# Altium schematic sheet COEXPIX schematics.SchDoc
size A4
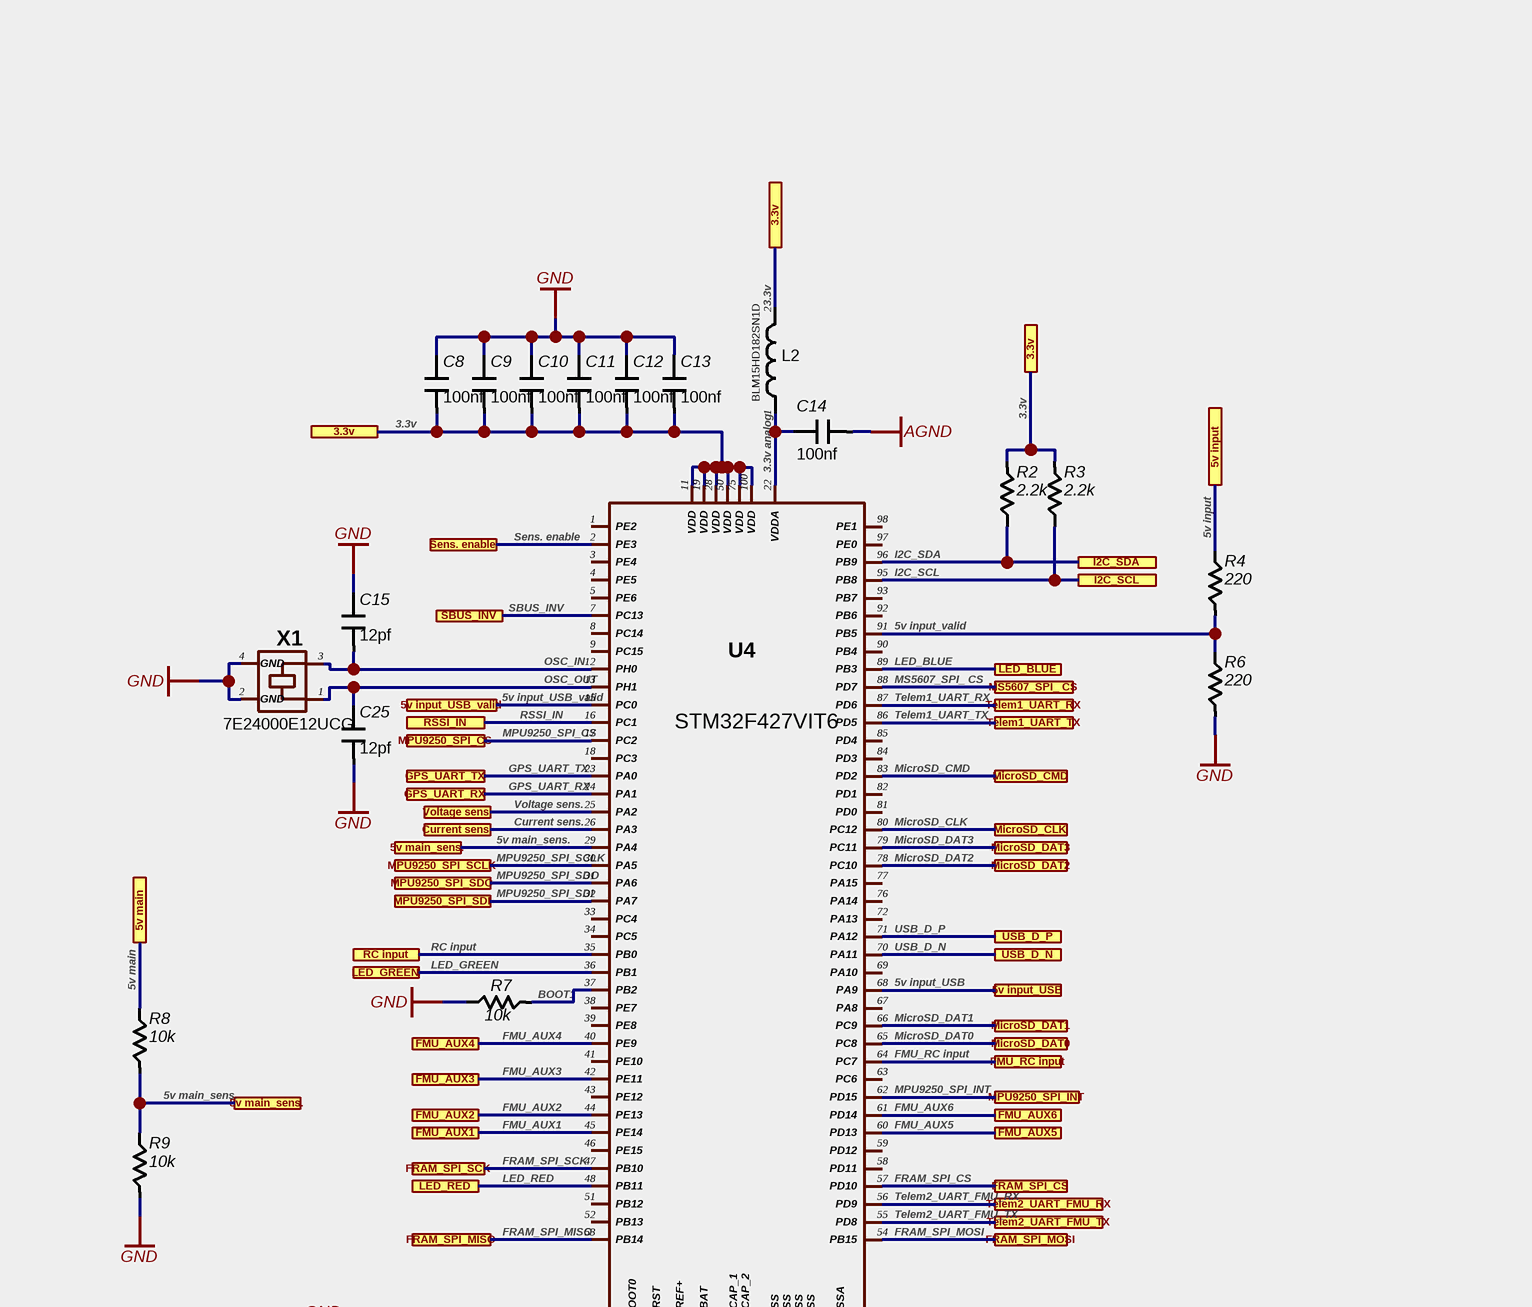
[diagram p0: COEXPIX schematics.SchDoc, top left]
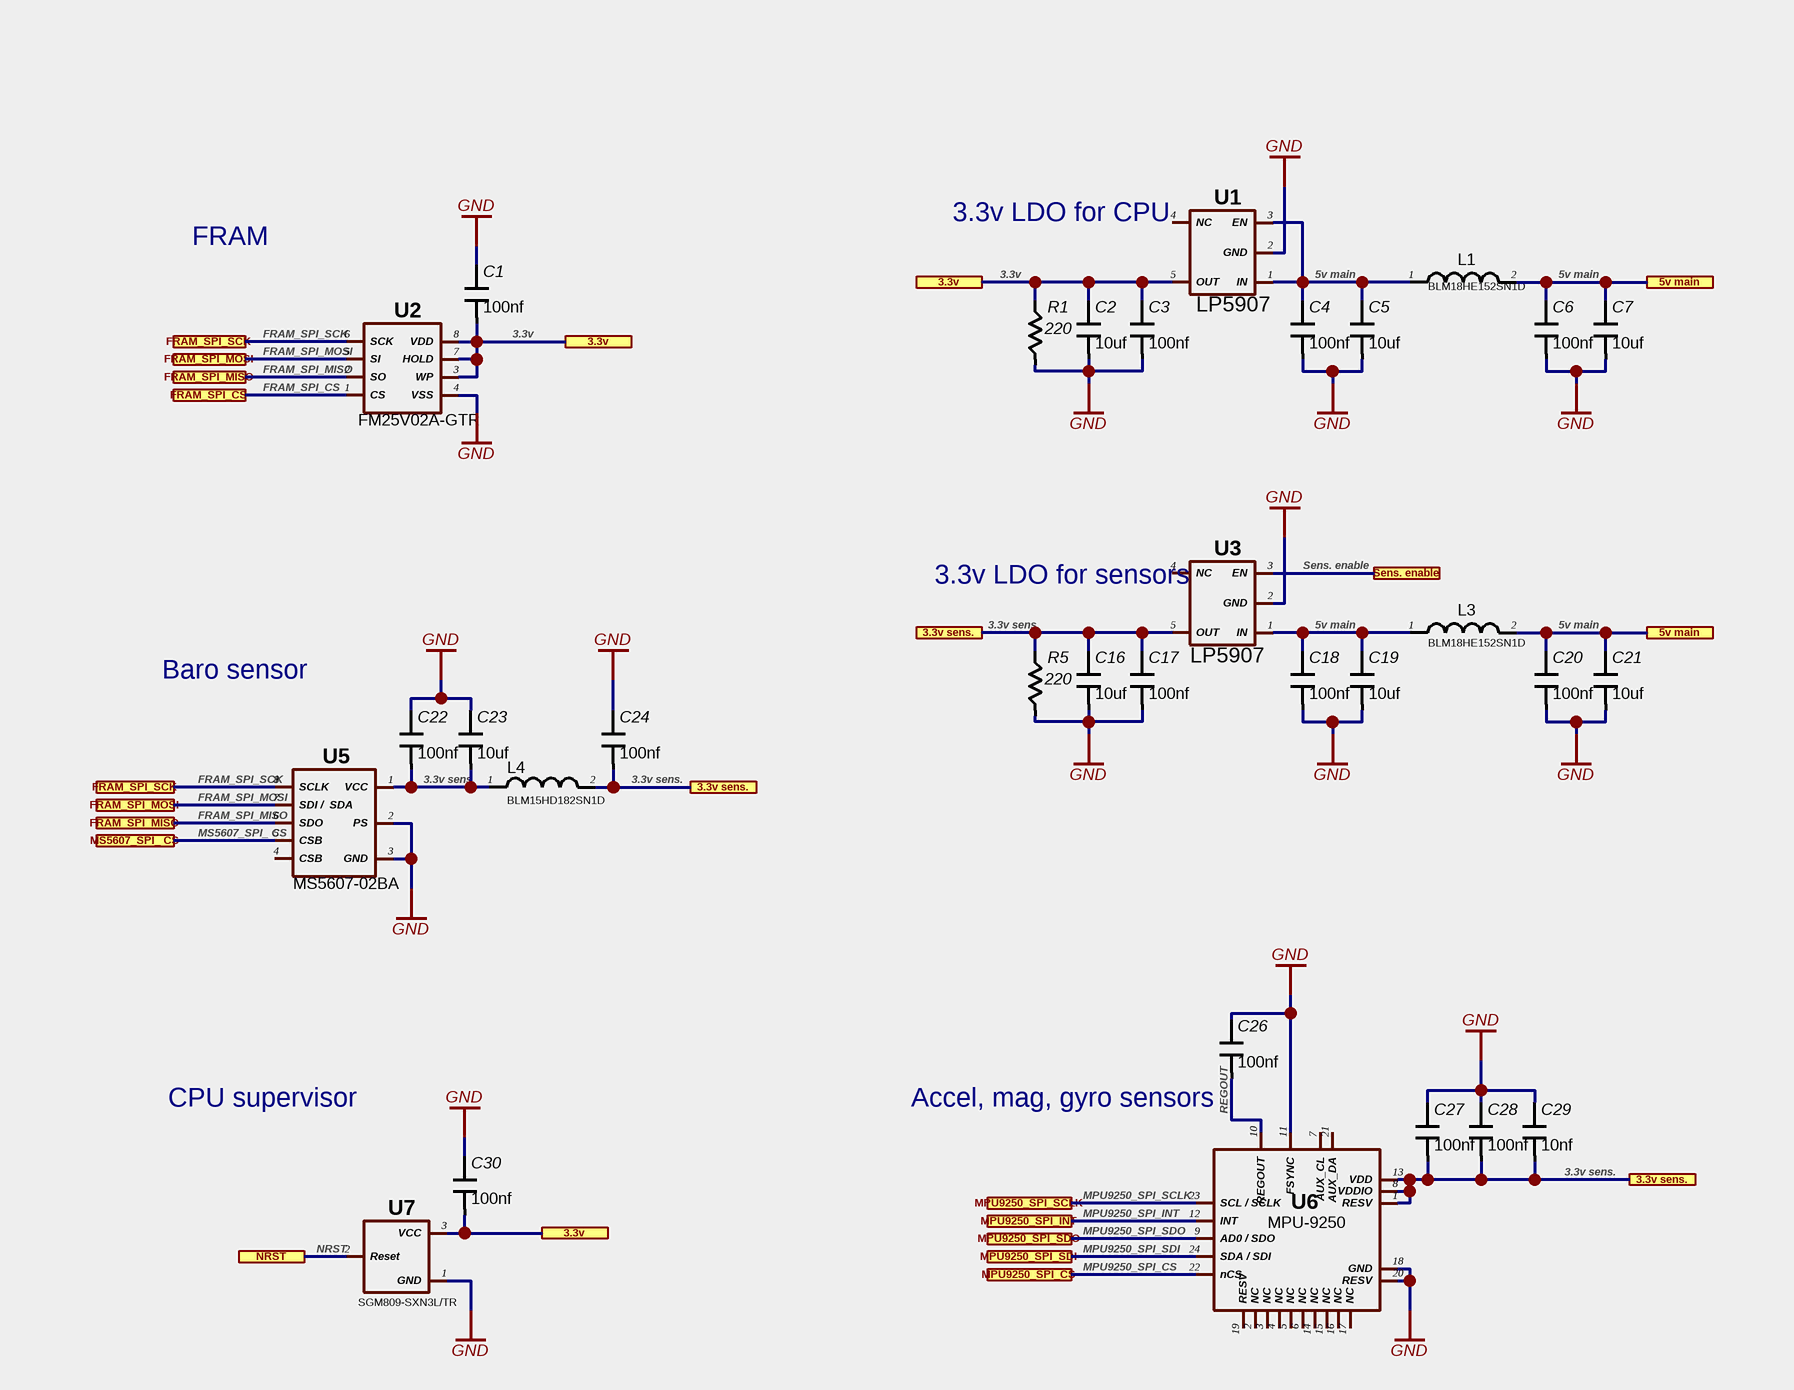
[diagram p1: COEXPIX schematics.SchDoc, top right]
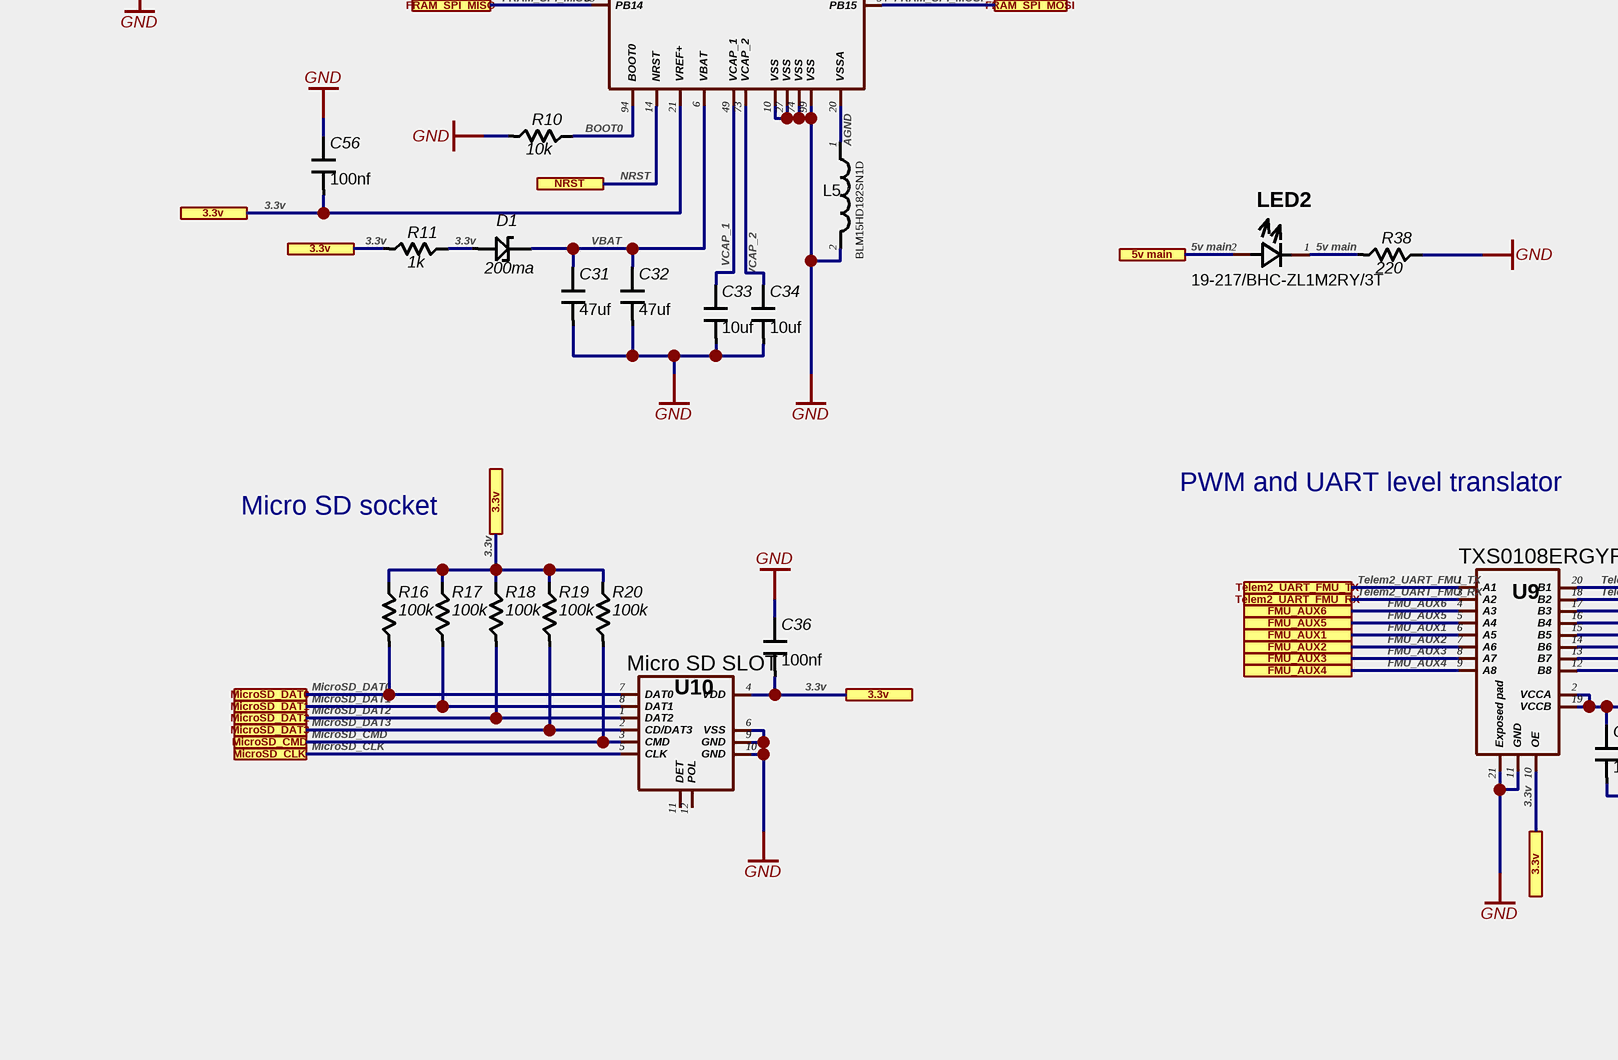
[diagram p2: COEXPIX schematics.SchDoc, bottom left]
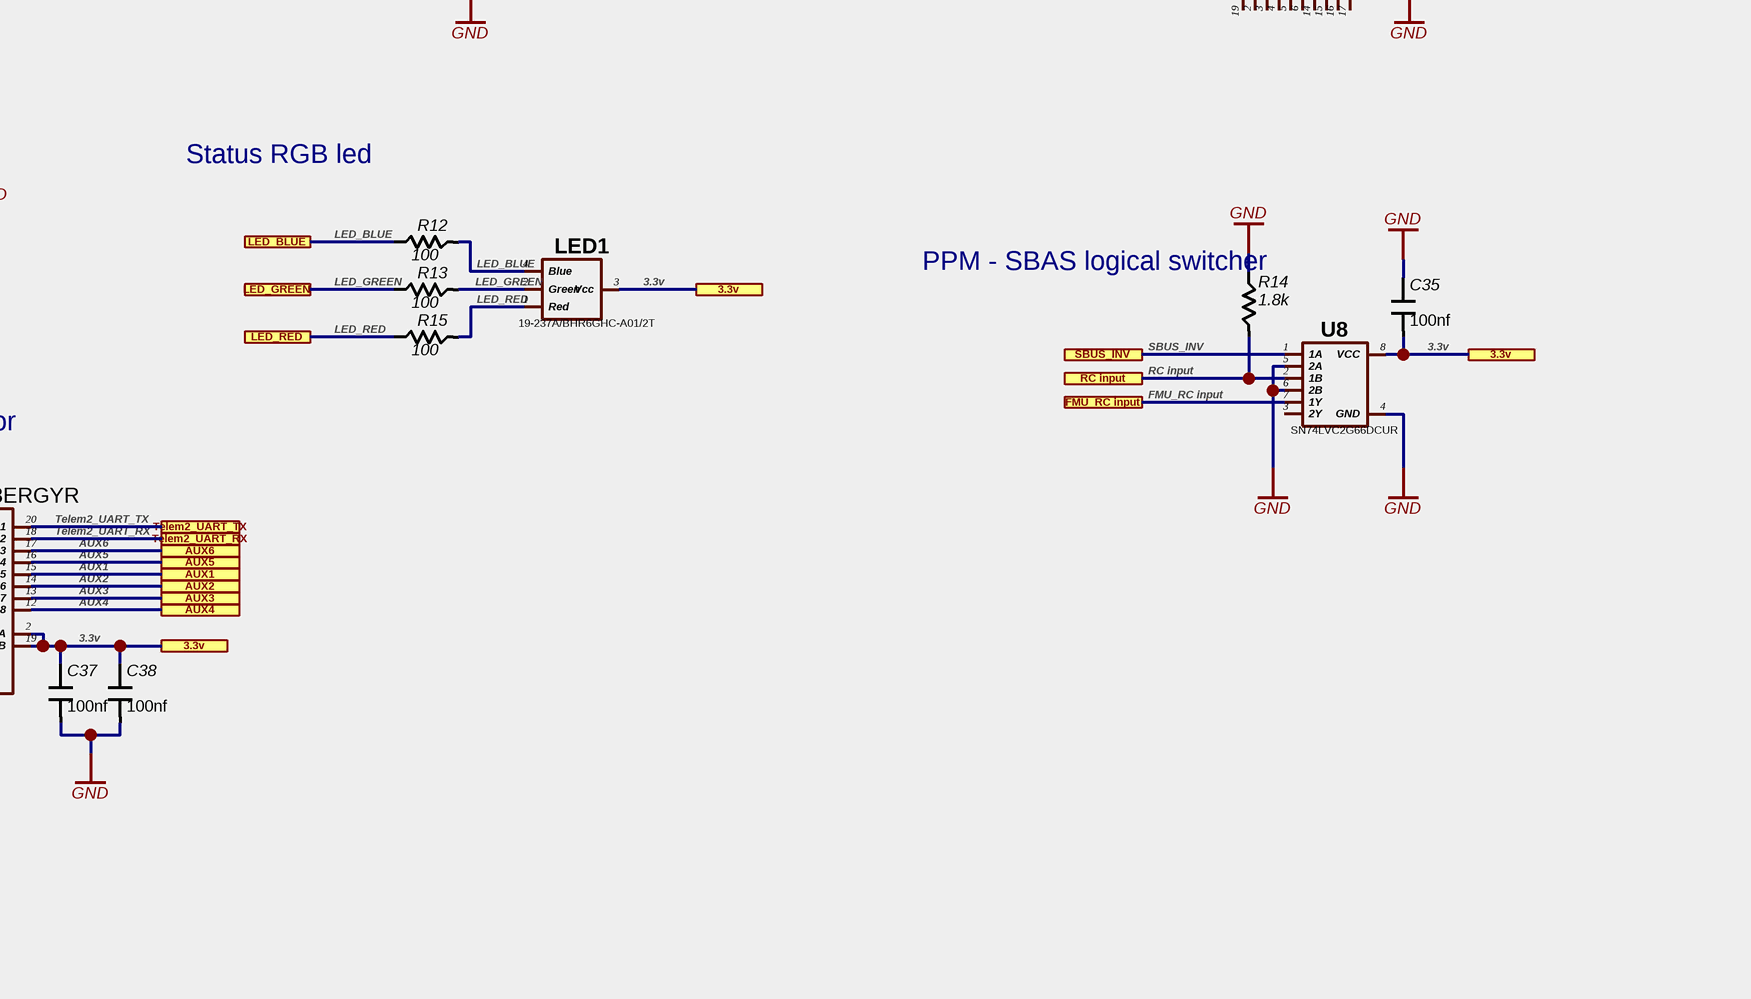
[diagram p3: COEXPIX schematics.SchDoc, bottom right]

## Parts
C1  100nf  [Capasitor 0402]
C2  10uf  [Capasitor 0402]
C3  100nf  [Capasitor 0402]
C4  100nf  [Capasitor 0402]
C5  10uf  [Capasitor 0402]
C6  100nf  [Capasitor 0402]
C7  10uf  [Capasitor 0402]
C8  100nf  [Capasitor 0402]
C9  100nf  [Capasitor 0402]
C10  100nf  [Capasitor 0402]
C11  100nf  [Capasitor 0402]
C12  100nf  [Capasitor 0402]
C13  100nf  [Capasitor 0402]
C14  100nf  [Capasitor 0402]
C15  12pf  [Capasitor 0402]
C16  10uf  [Capasitor 0402]
C17  100nf  [Capasitor 0402]
C18  100nf  [Capasitor 0402]
C19  10uf  [Capasitor 0402]
C20  100nf  [Capasitor 0402]
C21  10uf  [Capasitor 0402]
C22  100nf  [Capasitor 0402]
C23  10uf  [Capasitor 0402]
C24  100nf  [Capasitor 0402]
C25  12pf  [Capasitor 0402]
C26  100nf  [Capasitor 0402]
C27  100nf  [Capasitor 0402]
C28  100nf  [Capasitor 0402]
C29  10nf  [Capasitor 0402]
C30  100nf  [Capasitor 0402]
C31  47uf  [Capasitor 0603]
C32  47uf  [Capasitor 0603]
C33  10uf  [Capasitor 0402]
C34  10uf  [Capasitor 0402]
C35  100nf  [Capasitor 0402]
C36  100nf  [Capasitor 0402]
C37  100nf  [Capasitor 0402]
C38  100nf  [Capasitor 0402]
C56  100nf  [Capasitor 0402]
D1  200ma  [SOD-523F]
L1  BLM18HE152SN1D  [Ferrite bead 0603]
L2  BLM15HD182SN1D  [Ferrite bead 0402]
L3  BLM18HE152SN1D  [Ferrite bead 0603]
L4  BLM15HD182SN1D  [Ferrite bead 0402]
L5  BLM15HD182SN1D  [Ferrite bead 0402]
LED1  19-237A/BHR6GHC-A01/2T  [Everlight RGB LED]
LED2  19-217/BHC-ZL1M2RY/3T  [Led 0603]
R1  220  [Resistor 0603]
R2  2.2k  [Resistor 0402]
R3  2.2k  [Resistor 0402]
R4  220  [Resistor 0402]
R5  220  [Resistor 0603]
R6  220  [Resistor 0402]
R7  10k  [Resistor 0402]
R8  10k  [Resistor 0402]
R9  10k  [Resistor 0402]
R10  10k  [Resistor 0402]
R11  1k  [Resistor 0402]
R12  100  [Resistor 0402]
R13  100  [Resistor 0402]
R14  1.8k  [Resistor 0402]
R15  100  [Resistor 0402]
R16  100k  [Resistor 0402]
R17  100k  [Resistor 0402]
R18  100k  [Resistor 0402]
R19  100k  [Resistor 0402]
R20  100k  [Resistor 0402]
R38  220  [Resistor 0402]
U1  LP5907  [SOT23-5]
U2  FM25V02A-GTR  [SOIC-8]
U3  LP5907  [SOT23-5]
U4  STM32F427VIT6  [LQFP100]
U5  MS5607-02BA  [MS5611]
U6  MPU-9250  [mpu9250]
U7  SGM809-SXN3L/TR  [SOT23-3 LP]
U8  SN74LVC2G66DCUR  [VSSOP8 0.5mm]
U9  TXS0108ERGYR  [TXS0108ERGYR]
U10  Micro SD SLOT  [Micro SD slot]
X1  7E24000E12UCG  [SMD-2520_4P]

## Ports
3.3v, 3.3v sens., 5v input, 5v input_USB, 5v input_USB_valid, 5v main, 5v main_sens., AUX1, AUX2, AUX3, AUX4, AUX5, AUX6, Current sens., FMU_AUX1, FMU_AUX2, FMU_AUX3, FMU_AUX4, FMU_AUX5, FMU_AUX6, FMU_RC input, FRAM_SPI_CS, FRAM_SPI_MISO, FRAM_SPI_MOSI, FRAM_SPI_SCK, GPS_UART_RX, GPS_UART_TX, I2C_SCL, I2C_SDA, LED_BLUE, LED_GREEN, LED_RED, MicroSD_CLK, MicroSD_CMD, MicroSD_DAT0, MicroSD_DAT1, MicroSD_DAT2, MicroSD_DAT3, MPU9250_SPI_CS, MPU9250_SPI_INT, MPU9250_SPI_SCLK, MPU9250_SPI_SDI, MPU9250_SPI_SDO, MS5607_SPI_ CS, NRST, RC input, RSSI_IN, SBUS_INV, Sens. enable, Telem1_UART_RX, Telem1_UART_TX, Telem2_UART_FMU_RX, Telem2_UART_FMU_TX, Telem2_UART_RX, Telem2_UART_TX, USB_D_N, USB_D_P, Voltage sens.

## Nets
AGND: C14.2 L5.1 U4.20(VSSA)
GND: C1.1 C2.2 C3.2 C4.2 C5.2 C6.2 C7.2 C8.1 C9.1 C10.1 C11.1 C12.1 C13.1 C15.1 C16.2 C17.2 C18.2 C19.2 C20.2 C21.2 C22.1 C23.1 C24.1 C25.2 C26.1 C27.1 C28.1 C29.1 C30.1 C31.2 C32.2 C33.2 C34.2 C35.1 C36.1 C37.2 C38.2 C56.1 L5.2 R1.2 R5.2 R6.2 R7.1 R9.2 R10.2 R14.1 R38.1 U1.2(GND) U2.4(VSS) U3.2(GND) U4.10(VSS) U4.27(VSS) U4.74(VSS) U4.99(VSS) U5.2(PS) U5.3(GND) U6.11(FSYNC) U6.18(GND) U6.20(RESV) U7.1(GND) U8.4(GND) U8.5(2A) U8.6(2B) U9.11(GND) U9.21(Exposed_pad) U10.6(VSS) U10.9(GND) U10.10(GND) X1.2(GND) X1.4(GND)
3.3v: C1.2 C2.1 C3.1 C8.2 C9.2 C10.2 C11.2 C12.2 C13.2 C30.2 C35.2 C36.2 C37.1 C38.1 C56.2 D1.2 L2.2 LED1.3(Vcc) R1.1 R2.2 R3.2 R11.1 R11.2 R16.1 R17.1 R18.1 R19.1 R20.1 U1.5(OUT) U2.3(WP) U2.7(HOLD) U2.8(VDD) U4.11(VDD) U4.19(VDD) U4.21(VREF+) U4.28(VDD) U4.50(VDD) U4.75(VDD) U4.100(VDD) U7.3(VCC) U8.8(VCC) U9.2(VCCA) U9.10(OE) U9.19(VCCB) U10.4(VDD) ; port 3.3v
3.3v analog: C14.1 L2.1 U4.22(VDDA)
3.3v sens.: C16.1 C17.1 C22.2 C23.2 C24.2 C27.2 C28.2 C29.2 L4.1 L4.2 R5.1 U3.5(OUT) U5.1(VCC) U6.1(RESV) U6.8(VDDIO) U6.13(VDD) ; port 3.3v sens.
5v input: R4.1 ; port 5v input
5v input_USB: U4.68(PA9) ; port 5v input_USB
5v input_USB_valid: U4.15(PC0) ; port 5v input_USB_valid
5v input_valid: R4.2 R6.1 U4.91(PB5)
5v main: C4.1 C5.1 C6.1 C7.1 C18.1 C19.1 C20.1 C21.1 L1.1 L1.2 L3.1 L3.2 LED2.1 LED2.2 R8.1 R38.2 U1.1(IN) U1.3(EN) U3.1(IN) ; port 5v main
5v main_sens.: R8.2 R9.1 U4.29(PA4) ; port 5v main_sens.
AUX1: U9.15(B5) ; port AUX1
AUX2: U9.14(B6) ; port AUX2
AUX3: U9.13(B7) ; port AUX3
AUX4: U9.12(B8) ; port AUX4
AUX5: U9.16(B4) ; port AUX5
AUX6: U9.17(B3) ; port AUX6
BOOT0: R10.1 U4.94(BOOT0)
BOOT1: R7.2 U4.37(PB2)
Current sens.: U4.26(PA3) ; port Current sens.
FMU_AUX1: U4.45(PE14) U9.6(A5) ; port FMU_AUX1
FMU_AUX2: U4.44(PE13) U9.7(A6) ; port FMU_AUX2
FMU_AUX3: U4.42(PE11) U9.8(A7) ; port FMU_AUX3
FMU_AUX4: U4.40(PE9) U9.9(A8) ; port FMU_AUX4
FMU_AUX5: U4.60(PD13) U9.5(A4) ; port FMU_AUX5
FMU_AUX6: U4.61(PD14) U9.4(A3) ; port FMU_AUX6
FMU_RC input: U4.64(PC7) U8.7(1Y) ; port FMU_RC input
FRAM_SPI_CS: U2.1(CS) U4.57(PD10) ; port FRAM_SPI_CS
FRAM_SPI_MISO: U2.2(SO) U4.53(PB14) U5.6(SDO) ; port FRAM_SPI_MISO
FRAM_SPI_MOSI: U2.5(SI) U4.54(PB15) U5.7(SDI_/__SDA) ; port FRAM_SPI_MOSI
FRAM_SPI_SCK: U2.6(SCK) U4.47(PB10) U5.8(SCLK) ; port FRAM_SPI_SCK
GPS_UART_RX: U4.24(PA1) ; port GPS_UART_RX
GPS_UART_TX: U4.23(PA0) ; port GPS_UART_TX
I2C_SCL: R3.1 U4.95(PB8) ; port I2C_SCL
I2C_SDA: R2.1 U4.96(PB9) ; port I2C_SDA
LED_BLUE: LED1.4(Blue) R12.1 R12.2 U4.89(PB3) ; port LED_BLUE
LED_GREEN: LED1.2(Green) R13.1 R13.2 U4.36(PB1) ; port LED_GREEN
LED_RED: LED1.1(Red) R15.1 R15.2 U4.48(PB11) ; port LED_RED
MicroSD_CLK: U4.80(PC12) U10.5(CLK) ; port MicroSD_CLK
MicroSD_CMD: R20.2 U4.83(PD2) U10.3(CMD) ; port MicroSD_CMD
MicroSD_DAT0: R16.2 U4.65(PC8) U10.7(DAT0) ; port MicroSD_DAT0
MicroSD_DAT1: R17.2 U4.66(PC9) U10.8(DAT1) ; port MicroSD_DAT1
MicroSD_DAT2: R18.2 U4.78(PC10) U10.1(DAT2) ; port MicroSD_DAT2
MicroSD_DAT3: R19.2 U4.79(PC11) U10.2(CD/DAT3) ; port MicroSD_DAT3
MPU9250_SPI_CS: U4.17(PC2) U6.22(nCS) ; port MPU9250_SPI_CS
MPU9250_SPI_INT: U4.62(PD15) U6.12(INT) ; port MPU9250_SPI_INT
MPU9250_SPI_SCLK: U4.30(PA5) U6.23(SCL_/_SCLK) ; port MPU9250_SPI_SCLK
MPU9250_SPI_SDI: U4.32(PA7) U6.24(SDA_/_SDI) ; port MPU9250_SPI_SDI
MPU9250_SPI_SDO: U4.31(PA6) U6.9(AD0_/_SDO) ; port MPU9250_SPI_SDO
MS5607_SPI_ CS: U4.88(PD7) U5.5(CSB) ; port MS5607_SPI_ CS
NRST: U4.14(NRST) U7.2(Reset) ; port NRST
OSC_IN: C15.2 U4.12(PH0) X1.3
OSC_OUT: C25.1 U4.13(PH1) X1.1
RC input: R14.2 U4.35(PB0) U8.2(1B) ; port RC input
REGOUT: C26.2 U6.10(REGOUT)
RSSI_IN: U4.16(PC1) ; port RSSI_IN
SBUS_INV: U4.7(PC13) U8.1(1A) ; port SBUS_INV
Sens. enable: U3.3(EN) U4.2(PE3) ; port Sens. enable
Telem1_UART_RX: U4.87(PD6) ; port Telem1_UART_RX
Telem1_UART_TX: U4.86(PD5) ; port Telem1_UART_TX
Telem2_UART_FMU_RX: U4.56(PD9) U9.3(A2) ; port Telem2_UART_FMU_RX
Telem2_UART_FMU_TX: U4.55(PD8) U9.1(A1) ; port Telem2_UART_FMU_TX
Telem2_UART_RX: U9.18(B2) ; port Telem2_UART_RX
Telem2_UART_TX: U9.20(B1) ; port Telem2_UART_TX
USB_D_N: U4.70(PA11) ; port USB_D_N
USB_D_P: U4.71(PA12) ; port USB_D_P
VBAT: C31.1 C32.1 D1.1 U4.6(VBAT)
VCAP_1: C33.1 U4.49(VCAP_1)
VCAP_2: C34.1 U4.73(VCAP_2)
Voltage sens.: U4.25(PA2) ; port Voltage sens.

Not connected (* = marked no-connect by the designer): U1 4(NC); U3 4(NC); U4 1(PE2) 3(PE4) 4(PE5) 5(PE6) 8(PC14) 9(PC15) 18(PC3) 33(PC4) 34(PC5) 38(PE7) 39(PE8) 41(PE10) 43(PE12) 46(PE15) 51(PB12) 52(PB13) 58(PD11) 59(PD12) 63(PC6) 67(PA8) 69(PA10) 72(PA13) 76(PA14) 77(PA15) 81(PD0) 82(PD1) 84(PD3) 85(PD4) 90(PB4) 92(PB6) 93(PB7) 97(PE0) 98(PE1); U5 4(CSB); U6 2(NC) 3(NC) 4(NC) 5(NC) 6(NC) 7(AUX_CL) 14(NC) 15(NC) 16(NC) 17(NC) 19(RESV) 21(AUX_DA); U8 3(2Y); U10 11(DET) 12(POL)

## Notes on the sheet
- FRAM
- (near U1) 3.3v LDO for CPU
- (near U3) 3.3v LDO for sensors
- Baro sensor
- CPU supervisor
- (near C26) Accel, mag, gyro sensors
- Status RGB led
- (near R14) PPM - SBAS logical switcher
- Micro SD socket
- (near U9) PWM and UART level translator

## Library data of the parts
C1 C3 C4 C6 C8-C14 C17 C18 C20 C22 C24 C26-C28 C30 C35-C38 C56 = Capacitor MLCC: Multilayer Ceramic Capacitors MLCC - SMD/SMT 100nF 16V 0402; Part number: CC0402KRX7R7BB104; Manufacturer: YAGEO; Component package: 0402; HelpURL: https://lcsc.com/product-detail/Multilayer-Ceramic-Capacitors-MLCC-SMD-SMT_100nF-104-10-16V_C60474.html; Value: 100nf
C2 C5 C16 C19 C33 C34 = Capacitor MLCC: Multilayer Ceramic Capacitors MLCC - SMD/SMT 10uF 6.3V 0402; Part number: JMK105CBJ106MV-F; Manufacturer: Taiyo Yuden; Component package: 0402; HelpURL: https://lcsc.com/product-detail/Multilayer-Ceramic-Capacitors-MLCC-SMD-SMT_TAIYO-YUDEN_JMK105CBJ106MV-F_10uF-106-20-6-3V_C87148.html; Value: 10uf
C7 C21 C23 = Capacitor MLCC: X5R 6.3v 10uf; Part number: JMK105CBJ106MV-F; Manufacturer: Taiyo Yuden; Component package: 0402; HelpURL: https://lcsc.com/product-detail/Multilayer-Ceramic-Capacitors-MLCC-SMD-SMT_TAIYO-YUDEN_JMK105CBJ106MV-F_10uF-106-20-6-3V_C87148.html; Value: 10uf
C15 C25 = Capacitor MLCC: Multilayer Ceramic Capacitors MLCC - SMD/SMT 12pF 50V 0402; Part number: CC0402JRNPO9BN120; Manufacturer: YAGEO; Component package: 0402; HelpURL: https://lcsc.com/product-detail/Multilayer-Ceramic-Capacitors-MLCC-SMD-SMT_12pF-120-5-50V_C106201.html; Value: 12pf
C29 = Capacitor MLCC: Multilayer Ceramic Capacitors MLCC - SMD/SMT 10nF 50V 0402; Part number: CC0402KRX7R9BB103; Manufacturer: YAGEO; Component package: 0402; HelpURL: https://lcsc.com/product-detail/Multilayer-Ceramic-Capacitors-MLCC-SMD-SMT_10nF-103-10-50V_C60133.html; Value: 10nf
C31 C32 = Capacitor MLCC: Multilayer Ceramic Capacitors MLCC - SMD/SMT 47uF 6.3V 0603; Part number: GRM188R60J476ME15D; Manufacturer: Murata; Component package: 0603; HelpURL: https://lcsc.com/product-detail/Multilayer-Ceramic-Capacitors-MLCC-SMD-SMT_MuRata_GRM188R60J476ME15D_47uF-476-20-6-3V_C140782.html; Value: 47uf
D1 = Schottky barrier diode: Schottky Barrier Diodes (SBD) SOD-523; Part number: RB521S-30; Manufacturer: Shikues; HelpURL: https://lcsc.com/product-detail/Schottky-Barrier-Diodes-SBD_RB521S-30_C122862.html; Component package: SOD-523; Value: 200ma
L1 L3 = FB / Inductor: Beads 0603; Manufacturer: Murata; Component package: 0603; Value: 1.5 kOhm @100MHz; Part number: BLM18HE152SN1D; HelpURL: https://lcsc.com/product-detail/Ferrite-Beads-And-Chips_muRata_BLM18HE152SN1D_1-5KR-25-at100MHz_C82155.html
L2 L4 L5 = FB / Inductor: Beads 0402; Manufacturer: Murata Electronics; Component package: 0402; Value: 1.8 kOhm @100MHz; Part number: BLM15HD182SN1D; HelpURL: https://lcsc.com/product-detail/Ferrite-Beads-And-Chips_MuRata_BLM15HD182SN1D_1-8KR-at100MHz_C76888.html
LED1 = Everlight 19-237A: RGB LED; Part number: 19-237A/BHR6GHC-A01/2T; Manufacturer: Everlight; HelpURL: https://lcsc.com/product-detail/Light-Emitting-Diodes-LED_19-237A-BHR6GHC-A01-2T-RGB_C114830.html
LED2 = LED: Light Emitting Diodes (LED) Blue 465~475nm 11.5~28.5mcd@5mA Top View 0603; Manufacturer: Everlight Elec; Component package: 0603; Part number: 19-217/BHC-ZL1M2RY/3T; HelpURL: https://lcsc.com/product-detail/Light-Emitting-Diodes-LED_0603-Blue-light_C72041.html
R1 R5 = Resistor: Chip Resistor - Surface Mount 220Ohms ±1% 1/10W 0603; Part number: 0603WAF2200T5E; Manufacturer: Uniroyal Elec; Component package: 0603; HelpURL: https://lcsc.com/product-detail/Chip-Resistor-Surface-Mount_Uniroyal-Elec-0603WAF2200T5E_C22962.html; Value: 220
R2 R3 = Resistor: Chip Resistor - Surface Mount 2.2KOhms ±1% 1/16W 0402; Part number: RC0402FR-072K2L; Manufacturer: YAGEO; Component package: 0402; HelpURL: https://lcsc.com/product-detail/Chip-Resistor-Surface-Mount_2-2KR-2201-1_C114762.html; Value: 2.2k
R4 R6 R38 = Resistor: Chip Resistor - Surface Mount 220Ohms ±1% 1/16W 0402; Part number: 0402WGF2200TCE; Manufacturer: Uniroyal Elec; Component package: 0402; HelpURL: https://lcsc.com/product-detail/Chip-Resistor-Surface-Mount_Uniroyal-Elec-0402WGF2200TCE_C25091.html; Value: 220
R7-R10 = Resistor: Chip Resistor - Surface Mount 10KOhms ±1% 1/16W 0402; Part number: RC0402FR-0710KL; Manufacturer: YAGEO; Component package: 0402; HelpURL: https://lcsc.com/product-detail/Chip-Resistor-Surface-Mount_10KR-1002-1_C60490.html; Value: 10k
R11 = Resistor: Chip Resistor - Surface Mount 1KOhms ±1% 1/16W 0402; Part number: RC0402FR-071KL; Manufacturer: YAGEO; Component package: 0402; HelpURL: https://lcsc.com/product-detail/Chip-Resistor-Surface-Mount_1KR-1001-1_C106235.html; Value: 1k
R12 R13 R15 = Resistor: Chip Resistor - Surface Mount 100Ohms ±1% 1/16W 0402; Part number: RC0402FR-07100RL; Manufacturer: YAGEO; Component package: 0402; HelpURL: https://lcsc.com/product-detail/Chip-Resistor-Surface-Mount_100R-100R-1_C106232.html; Value: 100
R14 = Resistor: Chip Resistor - Surface Mount 1.8KOhms ±1% 1/16W 0402; Part number: 0402WGF1801TCE; Manufacturer: Uniroyal Elec; Component package: 0402; HelpURL: https://lcsc.com/product-detail/Chip-Resistor-Surface-Mount_Uniroyal-Elec-0402WGF1801TCE_C25871.html; Value: 1.8k
R16-R20 = Resistor: Chip Resistor - Surface Mount 100KOhms ±1% 1/16W 0402; Part number: RC0402FR-07100KL; Manufacturer: YAGEO; Component package: 0402; HelpURL: https://lcsc.com/product-detail/Chip-Resistor-Surface-Mount_100KR-1003-1_C60491.html; Value: 100k
U1 U3 = LP5907: Linear Voltage Regulators SOT-23-5; Manufacturer: Texas Instruments; Value: 3.3v; Part number: LP5907; HelpURL: https://lcsc.com/product-detail/Linear-Voltage-Regulators_TI_LP5907MFX-3-3-NOPB_LP5907MFX-3-3-NOPB_C80670.html; Component package: SOT23-5
U2 = FM25V02A: FRAM FRAM 256Kb (32K x 8) SPI SOIC-8_150mil; Manufacturer: Cypress Semicon; Component package: SOIC8; Part number: FM25V02A-GTR; HelpURL: https://lcsc.com/product-detail/FRAM_CYPRESS_FM25V02A-GTR_FM25V02A-GTR_C66029.html
U4 = STM32F427VIT6: ARM® Cortex®-M4 STM32F4 Microcontroller IC 32-Bit 180MHz 2MB (2M x 8) FLASH 100-LQFP (14x14); Manufacturer: STMicroelectronics; Part number: STM32F427VIT6; HelpURL: https://lcsc.com/product-detail/ST-Microelectronics_STMicroelectronics_STM32F427VIT6_STM32F427VIT6_C57097.html; Component package: LQFP100
U5 = MS5607-02BA: Manufacturer: meas-spec; Part number: MS5607-02BA; HelpURL: https://www.digikey.com/product-detail/en/te-connectivity-measurement-specialties/MS560702BA03-50/223-1198-1-ND/4700921
U6 = mpu9250: IMU ACCEL/GYRO/MAG I2C/SPI 24QFN; Manufacturer: TDK InvenSense; Component package: QFN24 3x3; Part number: MPU-9250; HelpURL: https://www.digikey.com/product-detail/en/tdk-invensense/MPU-9250/1428-1019-1-ND/4626450
U7 = SGM809-SXN3L/TR: Microprocessor & Microcontroller Supervisors Microprocessor Supervisory Active Low 2.93V SOT-23(SOT-23-3); Manufacturer: SGMICRO; Component package: SOT23-3; Part number: SGM809-SXN3L/TR; HelpURL: https://lcsc.com/product-detail/Microprocessor-Microcontroller-Supervisors_SGM809-SXN3L-TR_C49651.html
U8 = SN74LVC2G86DCUR: 74 Series SPST-NC 2 1.65V ~ 5.5V VSSOP-8_2x2.3x05P; Manufacturer: Texas Instruments; Component package: VSSOP8; Part number: SN74LVC2G66DCUR; HelpURL: https://lcsc.com/product-detail/Analog-Switches_TI_SN74LVC2G66DCUR_SN74LVC2G66DCUR_C181970.html
U9 = TXS0108ERGYR: Level Translators, Shifters VQFN-20; Manufacturer: Texas Instruments; Part number: TXS0108ERGYR; HelpURL: https://lcsc.com/product-detail/Logic-ICs_Texas-Instruments_TXS0108ERGYR_Texas-Instruments-TI-TXS0108ERGYR_C90706.html; Component package: VQFN-20
U10 = MicroSD socket: Part number: Micro SD SLOT; HelpURL: https://ru.aliexpress.com/item/32607835515.html?spm=a2g0s.9042311.0.0.274233edQMHmCa
X1 = Crystal oscillator: SMD Crystal Resonators 24MHz ±10ppm SMD-2520_4P; Manufacturer: SHENZHEN CRYSTAL TECH; Part number: 7E24000E12UCG; HelpURL: https://lcsc.com/product-detail/SMD-Crystal-Resonators_SHENZHEN-CRYSTAL-TECH-7E24000E12UCG_C252262.html; Component package: SMD-2520_4P; Value: 24 MHZ